# EAGLE schematic optodist 1.2 TH (EAGLE 6.5.0)
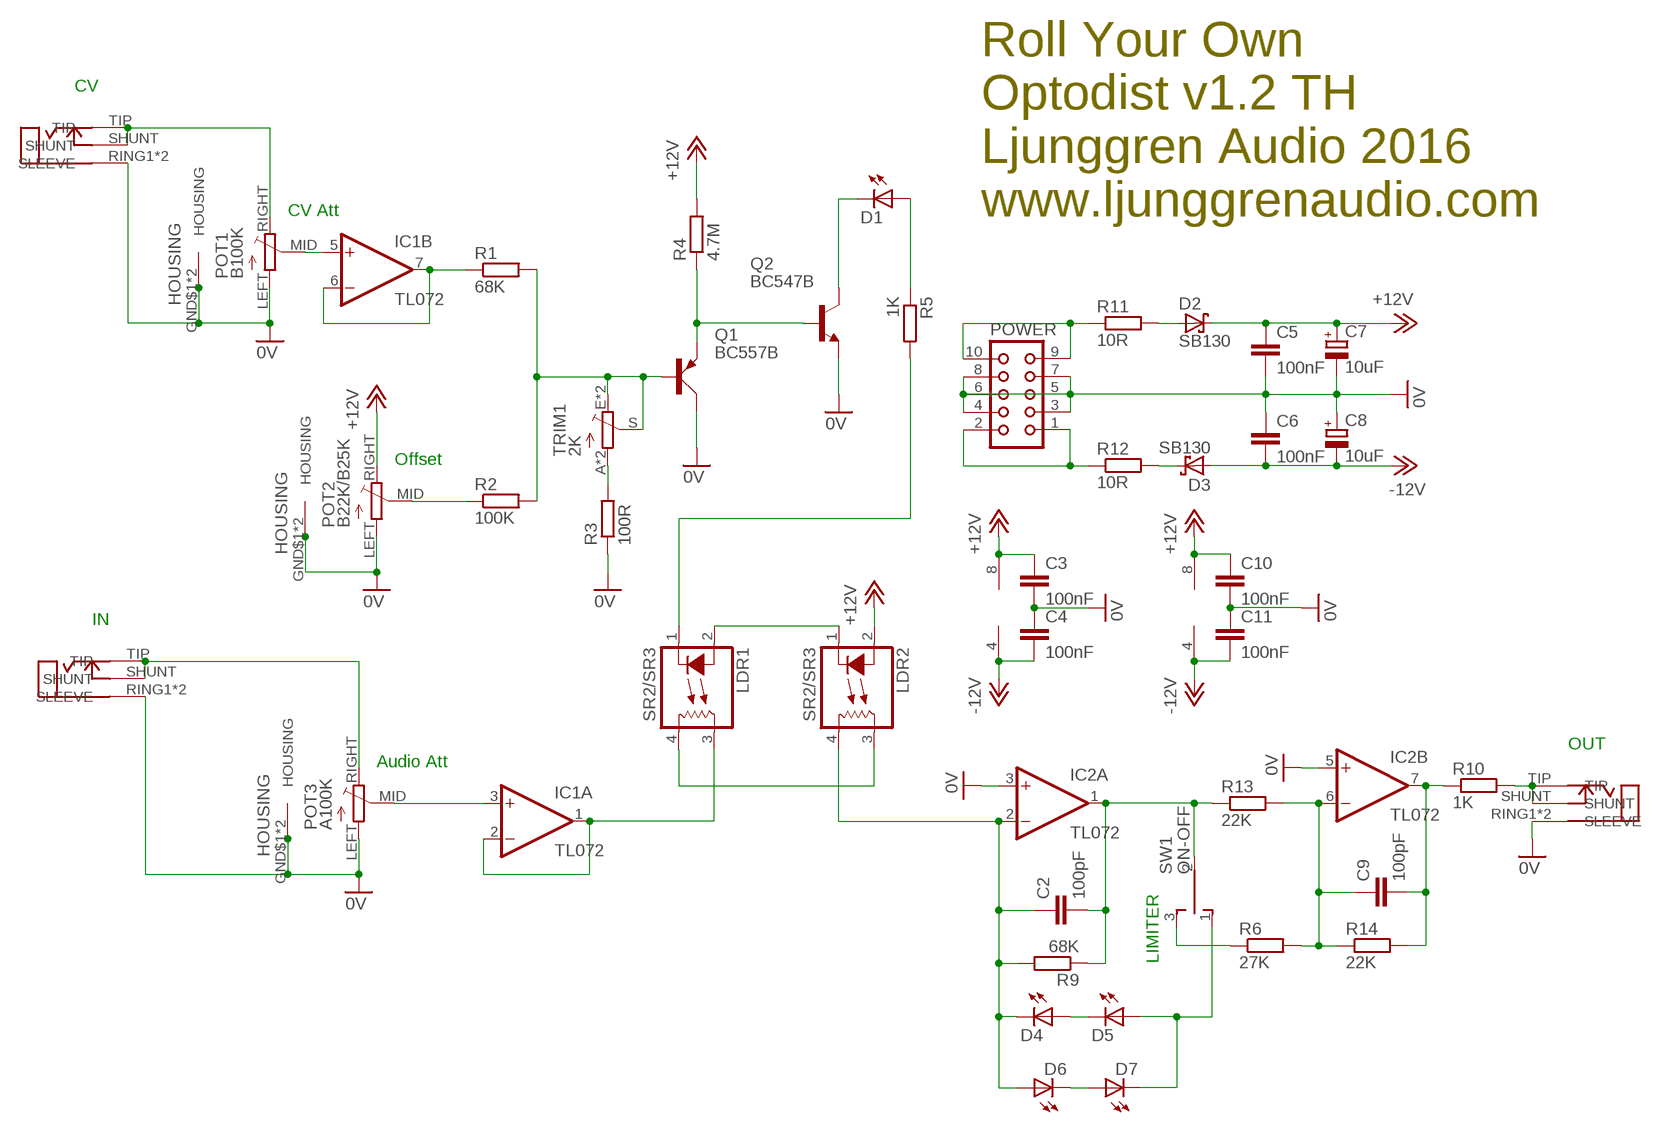
[diagram p0: schematic, sheet 1]

## Parts
C2  100pF  C-EU025-024X044  [C025-024X044]
C3  100nF  C-EU025-024X044  [C025-024X044]
C4  100nF  C-EU025-024X044  [C025-024X044]
C5  100nF  C-EU025-024X044  [C025-024X044]
C6  100nF  C-EU025-024X044  [C025-024X044]
C7  10uF  CPOL-EUE2-5  [E2-5]
C8  10uF  CPOL-EUE2-5  [E2-5]
C9  100pF  C-EU025-024X044  [C025-024X044]
C10  100nF  C-EU025-024X044  [C025-024X044]
C11  100nF  C-EU025-024X044  [C025-024X044]
CV  ERTHENVAR_3.5MM_JACKHOLES  [ERTHENVAR]
D1  LED3MM  [LED3MM]
D2  SB130  SB130DO-204AL  [DO41-7]
D3  SB130  SB130DO-204AL  [DO41-7]
D4  LED3MM  [LED3MM]
D5  LED3MM  [LED3MM]
D6  LED3MM  [LED3MM]
D7  LED3MM  [LED3MM]
IC1  TL072  TL072P  [DIL08]
IC2  TL072  TL072P  [DIL08]
IN  ERTHENVAR_3.5MM_JACKHOLES  [ERTHENVAR]
LDR1  SR2/SR3  VTL5C9SILONEX  [VTL5C]
LDR2  SR2/SR3  VTL5C9SILONEX  [VTL5C]
OUT  ERTHENVAR_3.5MM_JACKHOLES  [ERTHENVAR]
POT1  B100K  POT-ALPHA9  [POT-ALPHA9]
POT2  B22K/B25K  POT-ALPHA9  [POT-ALPHA9]
POT3  A100K  POT-ALPHA9  [POT-ALPHA9]
POWER  CON10L  [CON10L]
Q1  BC557B  BC557TO92-LINE  [TO92-LINE]
Q2  BC547B  BC547TO92-LINE  [TO92-LINE]
R1  68K  R-EU_0207/10  [0207/9]
R2  100K  R-EU_0207/10  [0207/9]
R3  100R  R-EU_0207/10  [0207/9]
R4  4.7M  R-EU_0207/10  [0207/9]
R5  1K  R-EU_0207/10  [0207/9]
R6  27K  R-EU_0207/10  [0207/9]
R9  68K  R-EU_0207/10  [0207/9]
R10  1K  R-EU_0207/10  [0207/9]
R11  10R  R-EU_0207/10  [0207/9]
R12  10R  R-EU_0207/10  [0207/9]
R13  22K  R-EU_0207/10  [0207/9]
R14  22K  R-EU_0207/10  [0207/9]
SW1  ON-OFF  SPDTTOP-SUBMINI  [SPDT-HORIZONTAL-TOP-SUBMINI-MULTICOMP]
TRIM1  2K  TRIM_EU-B25P  [B25P]

## Nets
0V: C3.2 C4.1 C5.2 C6.1 C7.- C8.+ C10.2 C11.1 CV.RING1(SLEEVE) CV.RING2(SLEEVE) IC2.3(A:+IN) IC2.5(B:+IN) IN.RING1(SLEEVE) IN.RING2(SLEEVE) OUT.RING1(SLEEVE) OUT.RING2(SLEEVE) POT1.GND$1(HOUSING) POT1.GND$2(HOUSING) POT1.LEFT POT2.GND$1(HOUSING) POT2.GND$2(HOUSING) POT2.LEFT POT3.GND$1(HOUSING) POT3.GND$2(HOUSING) POT3.LEFT POWER.3 POWER.4 POWER.5 POWER.6 POWER.7 POWER.8 Q1.3(C) Q2.1(E) R3.1
+12V: C3.1 C5.1 C7.+ C10.1 D2.C IC1.8(P:V+) IC2.8(P:V+) LDR2.2(A) POT2.RIGHT R4.2
-12V: C4.2 C6.2 C8.- C11.2 D3.A IC1.4(P:V-) IC2.4(P:V-)
AUDIO_IN: IC1.3(A:+IN) POT3.MID
AUDIO_OUT: C2.2 IC2.1(A:OUT) R9.1 R13.1 SW1.2
CV_IN: D1.A R5.1
N$1: IC1.6(B:-IN) IC1.7(B:OUT) R1.1
N$2: POT2.MID R2.1
N$3: Q1.2(B) R1.2 R2.2 TRIM1.E TRIM1.EE(E) TRIM1.S
N$4: Q1.1(E) Q2.2(B) R4.1
N$5: CV.SHUNT CV.TIP POT1.RIGHT
N$6: D1.K(C) Q2.3(C)
N$7: R3.2 TRIM1.A TRIM1.AA(A)
N$8: IN.SHUNT IN.TIP POT3.RIGHT
N$9: OUT.SHUNT OUT.TIP R10.2
N$10: IC1.1(A:OUT) IC1.2(A:-IN) LDR1.3(L1)
N$11: R6.1 SW1.3
N$12: C2.1 D4.K(C) D6.A IC2.2(A:-IN) LDR2.4(L2) R9.2
N$13: LDR1.1(C) R5.2
N$14: LDR1.2(A) LDR2.1(C)
N$15: LDR1.4(L2) LDR2.3(L1)
N$16: D2.A R11.2
N$17: C9.2 IC2.7(B:OUT) R10.1 R14.2
N$18: POWER.1 POWER.2 R12.1
N$19: POWER.9 POWER.10 R11.1
N$20: D3.C R12.2
N$21: C9.1 IC2.6(B:-IN) R6.2 R13.2 R14.1
N$22: IC1.5(B:+IN) POT1.MID
N$25: D4.A D5.K(C)
N$26: D6.K(C) D7.A
N$27: D5.A D7.K(C) SW1.1

## Notes on the sheet
- CV
- CV Att
- Roll Your Own
  Optodist v1.2 TH
  Ljunggren Audio 2016
  www.ljunggrenaudio.com
- HOUSING
- Offset
- HOUSING
- IN
- OUT
- Audio Att
- HOUSING
- LIMITER

## Library data of the parts
C2-C6 C9-C11 = Roll Your Own:C-EU: CAPACITOR, European symbol
C7 C8 = Roll Your Own:CPOL-EU: POLARIZED CAPACITOR, European symbol
CV IN OUT = Roll Your Own:ERTHENVAR_3.5MM_JACK
D1 D4-D7 = Roll Your Own:LED: LED OSRAM: - CHIPLED LG R971, LG N971, LY N971, LG Q971, LY Q971, LO R971, LY R971 LH N974, LH R974 LS Q976, LO Q976, LY Q976 LO Q996 - Hyper CHIPLED LW Q18S LB Q993, LB Q99A, LB R99A - SideLED LS A670, LO A670, LY A670, LG A670, LP A670 LB A673, LV A673, LT A673, LW A673 LH A674 LY A675 LS A676, LA A676, LO A676, LY A676, LW A676 LS A679, LY A679, LG A679 - Hyper Micro SIDELED® LS Y876, LA Y876, LO Y876, LY Y876 LT Y87S - SmartLED LW L88C, LW L88S LB L89C, LB L89S, LG L890 LS L89K, LO L89K, LY L89K LS L896, LA L896, LO L896, LY L896 - TOPLED LS T670, LO T670, LY T670, LG T670, LP T670 LSG T670, LSP T670, LSY T670, LOP T670, LYG T670 LG T671, LOG T671, LSG T671 LB T673, LV T673, LT T673, LW T673 LH T674 LS T676, LA T676, LO T676, LY T676, LB T676, LH T676, LSB T676, LW T676 LB T67C, LV T67C, LT T67C, LS T67K, LO T67K, LY T67K, LW E67C LS E67B, LA E67B, LO E67B, LY E67B, LB E67C, LV E67C, LT E67C LW T67C LS T679, LY T679, LG T679 LS T770, LO T770, LY T770, LG T770, LP T770 LB T773, LV T773, LT T773, LW T773 LH T774 LS E675, LA E675, LY E675, LS T675 LS T776, LA T776, LO T776, LY T776, LB T776 LHGB T686 LT T68C, LB T68C - Hyper Mini TOPLED® LB M676 - Mini TOPLED Santana® LG M470 LS M47K, LO M47K, LY M47K Source: http://www.osram.convergy.de LUXEON: - LUMILED® LXK2-PW12-R00, LXK2-PW12-S00, LXK2-PW14-U00, LXK2-PW14-V00 LXK2-PM12-R00, LXK2-PM12-S00, LXK2-PM14-U00 LXK2-PE12-Q00, LXK2-PE12-R00, LXK2-PE12-S00, LXK2-PE14-T00, LXK2-PE14-U00 LXK2-PB12-K00, LXK2-PB12-L00, LXK2-PB12-M00, LXK2-PB14-N00, LXK2-PB14-P00, LXK2-PB14-Q00 LXK2-PR12-L00, LXK2-PR12-M00, LXK2-PR14-Q00, LXK2-PR14-R00 LXK2-PD12-Q00, LXK2-PD12-R00, LXK2-PD12-S00 LXK2-PH12-R00, LXK2-PH12-S00 LXK2-PL12-P00, LXK2-PL12-Q00, LXK2-PL12-R00 Source: www.luxeon.com KINGBRIGHT: KA-3528ASYC Source: www.kingbright.com
D2 D3 = Roll Your Own:SB130
IC1 IC2 = Roll Your Own:TL072: OP AMP
LDR1 LDR2 = Roll Your Own:VTL5C*: Low Cost Axial Vactrols Source: www.perkinelmer.com/opto ... vtl5c9_c10.pdf; MF: VACTEC PHOTO; MPN: VTL5C9; OC_FARNELL: 2067857; OC_NEWARK: 95F9033
POT1-POT3 = Roll Your Own:POT-ALPHA9
POWER = Roll Your Own:CON10L: CONNECTOR; OC_FARNELL: unknown; OC_NEWARK: unknown
Q1 = Roll Your Own:BC557: PNP TRANSISTOR
Q2 = Roll Your Own:BC547: NPN TRANSISTOR
R1-R6 R9-R14 = Roll Your Own:R-EU_: RESISTOR, European symbol
SW1 = Roll Your Own:SPDT: Horizontal SPDT switch in the center-off position.
TRIM1 = Roll Your Own:TRIM_EU-: POTENTIOMETER